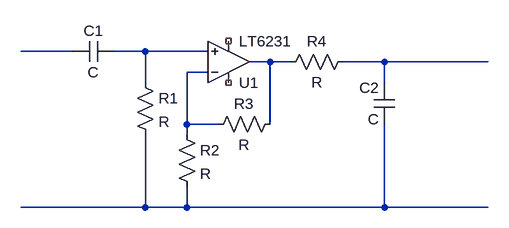
[diagram p0: schematic Band Pass filter .asc]
Band Pass filter .asc, the LTspice schematic file:
Version 4
SHEET 1 880 680
WIRE 176 256 96 256
WIRE 288 256 240 256
WIRE 384 256 288 256
WIRE 480 272 448 272
WIRE 512 272 480 272
WIRE 656 272 592 272
WIRE 816 272 656 272
WIRE 384 288 352 288
WIRE 288 304 288 256
WIRE 656 304 656 272
WIRE 352 368 352 288
WIRE 400 368 352 368
WIRE 480 368 480 272
WIRE 352 384 352 368
WIRE 288 496 288 384
WIRE 288 496 96 496
WIRE 352 496 352 464
WIRE 352 496 288 496
WIRE 656 496 656 368
WIRE 656 496 352 496
WIRE 816 496 656 496
SYMBOL Opamps/LT6231 416 272 M180
SYMATTR InstName U1
SYMBOL cap 240 240 R90
WINDOW 0 0 32 VBottom 2
WINDOW 3 32 32 VTop 2
SYMATTR InstName C1
SYMBOL cap 672 368 R180
WINDOW 0 24 56 Left 2
WINDOW 3 24 8 Left 2
SYMATTR InstName C2
SYMBOL res 272 288 R0
SYMATTR InstName R1
SYMBOL res 336 368 R0
SYMATTR InstName R2
SYMBOL res 496 352 R90
WINDOW 0 0 56 VBottom 2
WINDOW 3 32 56 VTop 2
SYMATTR InstName R3
SYMBOL res 608 256 R90
WINDOW 0 0 56 VBottom 2
WINDOW 3 32 56 VTop 2
SYMATTR InstName R4

The netlist it stands for:
* Band Pass filter .asc
XU1 N002 N005 N003 NC_01 NC_02 LT6231  ; pins In+ In- OUT V+ V-
C1 N002 N001 C
C2 N006 N004 C
R1 N002 N006 R
R2 N005 N006 R
R3 N003 N005 R
R4 N004 N003 R
.lib LTC2.lib
.backanno
.end